# Altium schematic sheet uz_frontpanel_main-mini.SchDoc
size A4; SheetNumber: 1; SheetTotal: 3; Website: www.ultrazohm.com
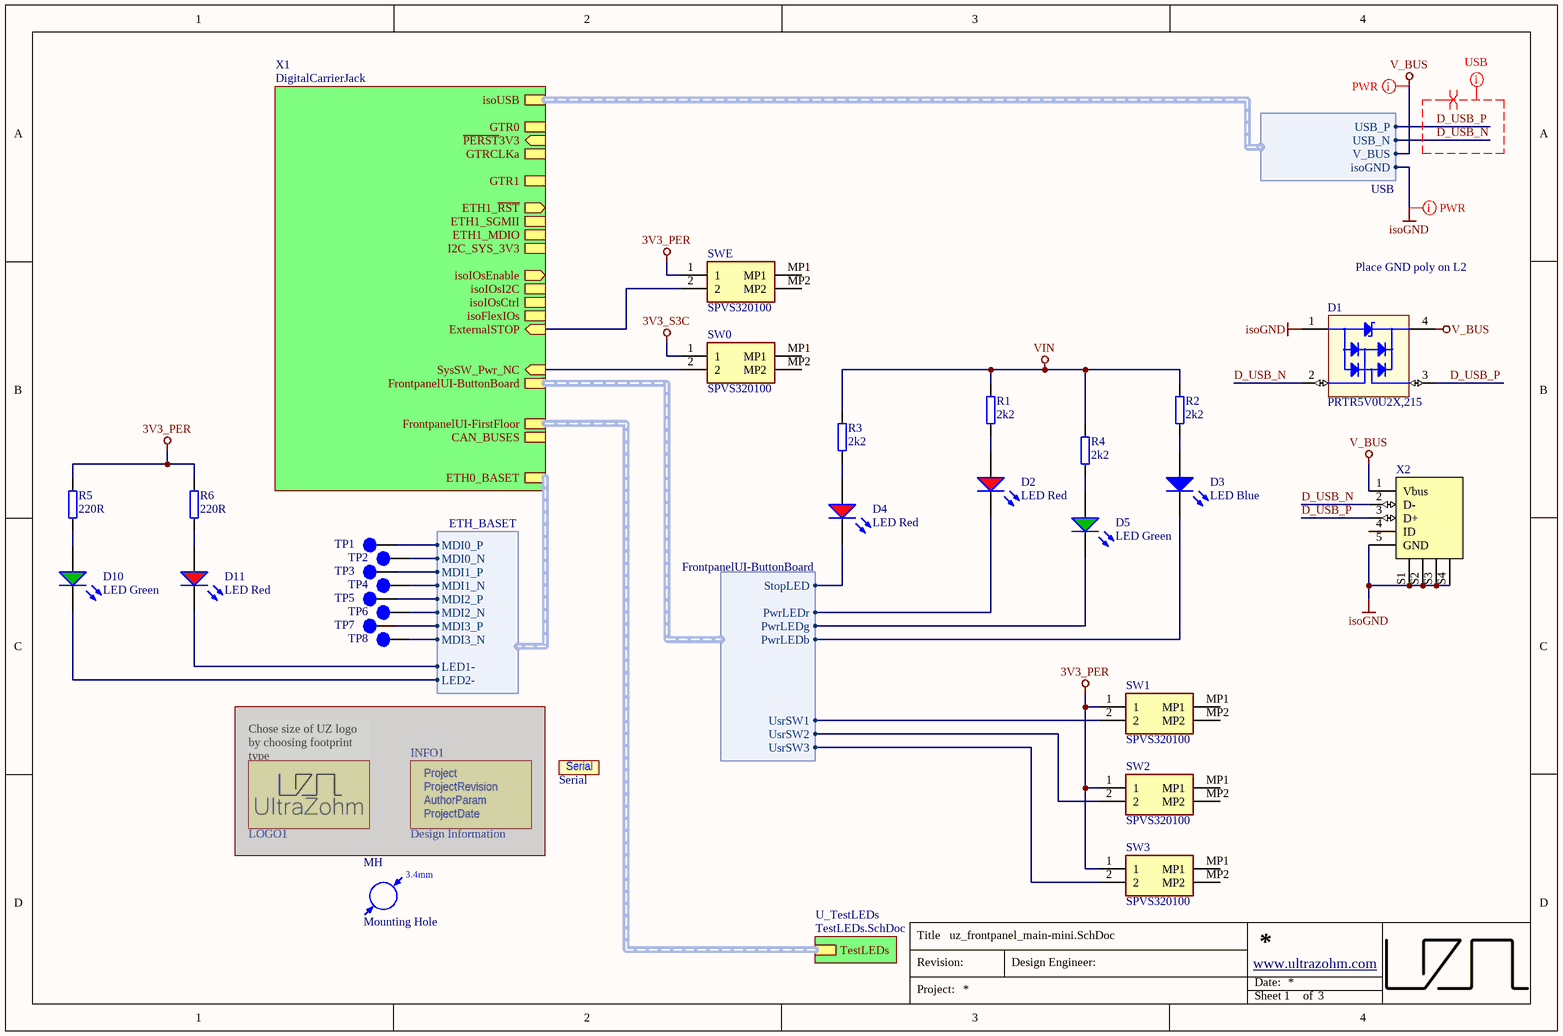
[diagram p0: uz_frontpanel_main-mini.SchDoc]

## Parts
D1  PRTR5V0U2X,215  [SOT-143B-4]
D2  LED Red  [WL-SMCW_0603]
D3  LED Blue  [WL-SMCW_0603]
D4  LED Red  [WL-SMCW_0603]
D5  LED Green  [WL-SMCW_0603]
D10  LED Green  [WL-SMCW_0603]
D11  LED Red  [WL-SMCW_0603]
INFO1  Design Information  [Design_info]  (no BOM)  (masked out: inside a compile mask, not in the netlist)
LOGO1  UZ Logo  [UZ_Logo_tiny]  (value not drawn)  (no BOM)  (masked out: inside a compile mask, not in the netlist)
MH  Mounting Hole  [MH_3.4]  (no BOM)
R1  2k2  [R_1206_TE]
R2  2k2  [R_1206_TE]
R3  2k2  [R_1206_TE]
R4  2k2  [R_1206_TE]
R5  220R  [R_0603_TE]
R6  220R  [R_0603_TE]
Serial  Serial #  [SERIAL]  (value not drawn)  (no BOM)
SW0  SPVS320100  [SPVS320100]
SW1  SPVS320100  [SPVS320100]
SW2  SPVS320100  [SPVS320100]
SW3  SPVS320100  [SPVS320100]
SWE  SPVS320100  [SPVS320100]
TP1  Testpoint 1mm  [TP_1mm]  (value not drawn)  (no BOM)
TP2  Testpoint 1mm  [TP_1mm]  (value not drawn)  (no BOM)
TP3  Testpoint 1mm  [TP_1mm]  (value not drawn)  (no BOM)
TP4  Testpoint 1mm  [TP_1mm]  (value not drawn)  (no BOM)
TP5  Testpoint 1mm  [TP_1mm]  (value not drawn)  (no BOM)
TP6  Testpoint 1mm  [TP_1mm]  (value not drawn)  (no BOM)
TP7  Testpoint 1mm  [TP_1mm]  (value not drawn)  (no BOM)
TP8  Testpoint 1mm  [TP_1mm]  (value not drawn)  (no BOM)
X2  Mini USB  [MINI_USB_5S_B _TYPE]  (value not drawn)

## Sub-sheets
U_TestLEDs = TestLEDs.SchDoc: TestLEDs (harness FrontpanelUI-FirstFloor)
X1 = DigitalCarrierJack: isoUSB (harness USB), ETH0_BASET (harness ETH_BASET), ETH1_~{RST} (out), ETH1_SGMII (harness ETH_SGMII), ETH1_MDIO (harness ETH_MDIO), GTR0 (harness GTR), ~{PERST}3V3 (in), GTRCLKa (harness MGTCLK), GTR1 (harness GTR), isoIOsEnable (out), isoIOsI2C (harness I2C), isoIOsCtrl (harness isoIOsCtrl), isoFlexIOs (harness isoFlexIOs), ExternalSTOP (in), SysSW_Pwr_NC (in), FrontpanelUI-ButtonBoard (harness FrontpanelUI-ButtonBoard), FrontpanelUI-FirstFloor (harness FrontpanelUI-FirstFloor), CAN_BUSES (harness CAN_BUSES), I2C_SYS_3V3 (harness I2C)

## Harnesses
USB: USB_P, USB_N, V_BUS, isoGND
FrontpanelUI-ButtonBoard: UsrSW1, UsrSW2, UsrSW3, StopLED, PwrLEDb, PwrLEDr, PwrLEDg
ETH_BASET: MDI0_P, MDI0_N, MDI1_P, MDI1_N, MDI2_P, MDI2_N, MDI3_P, MDI3_N, LED1-, LED2-

## Nets
3V3_PER: R5.2 R6.2 SW1.1 SW2.1 SW3.1 SWE.1
3V3_S3C: SW0.1
isoGND: D1.1(GND) X2.5(GND) X2.S1 X2.S2 X2.S3 X2.S4 ; sheet X1/isoUSB.isoGND
V_BUS: D1.4(REF) X2.1(Vbus) ; sheet X1/isoUSB.V_BUS
VIN: R1.2 R2.2 R3.2 R4.2
D_USB_N: D1.2(I/O) X2.2(D-) ; sheet X1/isoUSB.USB_N
D_USB_P: D1.3(I/O) X2.3(D+) ; sheet X1/isoUSB.USB_P
NetD2_1: D2.1(K) ; sheet X1/FrontpanelUI-ButtonBoard.PwrLEDr
NetD2_2: D2.2(A) R1.1
NetD3_1: D3.1(K) ; sheet X1/FrontpanelUI-ButtonBoard.PwrLEDb
NetD3_2: D3.2(A) R2.1
NetD4_1: D4.1(K) ; sheet X1/FrontpanelUI-ButtonBoard.StopLED
NetD4_2: D4.2(A) R3.1
NetD5_1: D5.1(K) ; sheet X1/FrontpanelUI-ButtonBoard.PwrLEDg
NetD5_2: D5.2(A) R4.1
NetD10_1: D10.1(K) ; sheet X1/ETH0_BASET.LED2-
NetD10_2: D10.2(A) R5.1
NetD11_1: D11.1(K) ; sheet X1/ETH0_BASET.LED1-
NetD11_2: D11.2(A) R6.1
NetSW0_2: SW0.2 ; sheet X1/SysSW_Pwr_NC
NetSW1_2: SW1.2 ; sheet X1/FrontpanelUI-ButtonBoard.UsrSW1
NetSW2_2: SW2.2 ; sheet X1/FrontpanelUI-ButtonBoard.UsrSW2
NetSW3_2: SW3.2 ; sheet X1/FrontpanelUI-ButtonBoard.UsrSW3
NetSWE_2: SWE.2 ; sheet X1/ExternalSTOP
NetTP1_1: TP1.1 ; sheet X1/ETH0_BASET.MDI0_P
NetTP2_1: TP2.1 ; sheet X1/ETH0_BASET.MDI0_N
NetTP3_1: TP3.1 ; sheet X1/ETH0_BASET.MDI1_P
NetTP4_1: TP4.1 ; sheet X1/ETH0_BASET.MDI1_N
NetTP5_1: TP5.1 ; sheet X1/ETH0_BASET.MDI2_P
NetTP6_1: TP6.1 ; sheet X1/ETH0_BASET.MDI2_N
NetTP7_1: TP7.1 ; sheet X1/ETH0_BASET.MDI3_P
NetTP8_1: TP8.1 ; sheet X1/ETH0_BASET.MDI3_N

Not connected (* = marked no-connect by the designer): SW0 MP1 MP2; SW1 MP1 MP2; SW2 MP1 MP2; SW3 MP1 MP2; SWE MP1 MP2; X2 4(ID)

## Buses and harness runs
harness sheet U_TestLEDs/TestLEDs = sheet X1/FrontpanelUI-FirstFloor

## Layout directives
differential pair: D_USB_N, D_USB_P
net class USB: D_USB_N, D_USB_P
net class PWR: isoGND, V_BUS

## Notes on the sheet
- Place GND poly on L2
- (near LOGO1) Chose size of UZ logo by choosing footprint type
- Title
- Revision:
- Design Engineer:
- Date:
- Project:
- Sheet
- of
- (in symbol Design Information) Project; ProjectRevision; AuthorParam; ProjectDate
- (in symbol Mounting Hole) 3.4mm

## Library data of the parts
D1 = PRTR5V0U2X,215: ESD Suppressors / TVS Diodes PRTR5V0U2X/SOT143/SOT4; Manufacturer: Nexperia; Type: TVS-Diode; Created from: AGeiger; Manufacturer Part Number: PRTR5V0U2X,215; PartID: 10; Created On: 26.11.2023 17:14:11; ComponentLink1Description: Datasheet; ComponentLink1URL: https://www.mouser.de/datasheet/2/916/PRTR5V0U2X-2938759.pdf; Component Type: TVS Diode, ESD; Device Package: SOT-143B-4; Last Updated: 26.11.2023 17:16:37; Mounting Type: SMD; Operating Temperature: -40 to 85 °C; Supplier 1: Mouser; Supplier Part Number 1: 771-PRTR5V0U2X-T/R; Supplier 2: LCSC; Supplier Part Number 2: C12333; Value: PRTR5V0U2X,215; Live Cycle Status: 1; LCSC Part Number: C12333
D2 D4 D11 = UZgen_LED_0603_Red: Standard LEDs - SMD 0603 red; Manufacturer: UZgen; Created from: UZgenTool; Manufacturer Part Number: UZgen_LED_0603_Red; PartID: 22; Created On: 09/09/2024 10:45:01; ComponentLink1Description: N/A; ComponentLink1URL: N/A; Component Type: LED Diode; Device Package: 0603; Last Updated: 09/09/2024 10:45:01; Mounting Type: SMD; Supplier 1: LCSC; Supplier Part Number 1: =LCSC Part Number; Type: Standard; Value: LED Red; Live Cycle Status: 1; Stock number: not stored; Color: red
D3 = UZgen_LED_0603_Blue: Standard LEDs - SMD 0603 blue; Manufacturer: UZgen; Created from: UZgenTool; Manufacturer Part Number: UZgen_LED_0603_Blue; PartID: 20; Created On: 09/09/2024 10:45:01; ComponentLink1Description: N/A; ComponentLink1URL: N/A; Component Type: LED Diode; Device Package: 0603; Last Updated: 09/09/2024 10:45:01; Mounting Type: SMD; Supplier 1: LCSC; Supplier Part Number 1: =LCSC Part Number; Type: Standard; Value: LED Blue; Live Cycle Status: 1; Stock number: not stored; Color: blue
D5 D10 = UZgen_LED_0603_Green: Standard LEDs - SMD 0603 green; Manufacturer: UZgen; Created from: UZgenTool; Manufacturer Part Number: UZgen_LED_0603_Green; PartID: 21; Created On: 09/09/2024 10:45:01; ComponentLink1Description: N/A; ComponentLink1URL: N/A; Component Type: LED Diode; Device Package: 0603; Last Updated: 09/09/2024 10:45:01; Mounting Type: SMD; Supplier 1: LCSC; Supplier Part Number 1: =LCSC Part Number; Type: Standard; Value: LED Green; Live Cycle Status: 1; Stock number: not stored; Color: green
INFO1 = Design Information: Manufacturer: UltraZohm; Created from: MGremer; Manufacturer Part Number: Design Information; PartID: 12; Created On: 03.11.2021 09:04:23; ComponentLink1Description: https://docs.ultrazohm.com/; ComponentLink1URL: homepage; Component Type: Design Information; Last Updated: 03.11.2021 09:28:34; Supplier 1: -; Supplier Part Number 1: -; Type: Design Information; Value: Design Information; Live Cycle Status: 1
LOGO1 = 1: Official Project Logo of the UltraZohm; Manufacturer: PCB Manufacturer; Manufacturer Part Number: UltraZohm Logo; Created from: T. Wendt; PartID: 1; Created On: 19.02.2021 16:55:56; ComponentLink1Description: Homepage; ComponentLink1URL: https://ultrazohm.com; Component Type: Logo; Last Updated: 02.03.2021 14:31:24; Type: Standard (No BOM); Live Cycle Status: 1
MH = Mounting Hole: Created from: MHlatky; Manufacturer Part Number: Mounting Hole; PartID: 16; Created On: 26/01/2021 09:19:51; ComponentLink1Description: Datasheet; Component Type: Mounting Hole; Device Package: -; Last Updated: 21/03/2022 23:05:12; Manufacturer: Mounting Hole; Supplier 1: Mounting Hole; Supplier Part Number 1: Mounting Hole; Type: Mounting Hole; Value: Mounting Hole; Live Cycle Status: 1; Stock number: not stored
R1-R4 = UZgen_R_1206_2k2: Generic resistor; Manufacturer: UZgen; Tolerance: 1 %; Created from: UZgenTool; Manufacturer Part Number: UZgen_R_1206_2k2; PartID: 516; Created On: 02/07/2024 17:29:56; Value: 2k2; Device Package: 1206; Mounting Type: SMD; Last Updated: 02/07/2024 17:29:56
R5 R6 = UZgen_R_0603_220R: Generic resistor; Manufacturer: UZgen; Tolerance: 1 %; Created from: UZgenTool; Manufacturer Part Number: UZgen_R_0603_220R; PartID: 205; Created On: 02/07/2024 17:29:49; Value: 220R; Device Package: 0603; Mounting Type: SMD; Last Updated: 02/07/2024 17:29:49
Serial = 6: Field to put in a serial number; Manufacturer: PCB Manufacturer; Created from: T. Wendt; PartID: 6; Created On: 02/03/2021 14:31:24; Component Type: Serial Number; Last Updated: 02/03/2021 14:31:24; Manufacturer Part Number: Serial Number; Type: Standard (No BOM); Live Cycle Status: 1
SW0-SW3 SWE = SPVS320100: Detector Switches 1 mAmp at 5 Volts 0.35 N; Manufacturer: Alps Alpine; Created from: FRosner; Manufacturer Part Number: SPVS320100; PartID: 45; Created On: 19/09/2024 10:04:55; ComponentLink1Description: Datasheet; ComponentLink1URL: https://www.mouser.de/datasheet/2/15/SPVS-1370820.pdf; Component Type: Detector Switches; Device Package: THT; Last Updated: 19/09/2024 10:04:55; Mounting Type: SMD; Supplier 1: Mouser; Supplier Part Number 1: 688-SPVS320100; Supplier 2: LCSC; Supplier Part Number 2: C160855; Type: Detector Switch; Value: SPVS320100; Live Cycle Status: 1; LCSC Part Number: C160855; Stock number: not stored
TP1-TP8 = NULL: Manufacturer Part Number: NULL; Created from: AGeiger; Created: 2018_06_25_AGeiger; Value: Testpoint 1mm; PartID: 9; Created On: 20/09/2022 13:14:57; Component Type: Testpoint; Last Updated: 20/09/2022 13:15:39; Manufacturer: NULL; Supplier 1: NULL; Supplier Part Number 1: NULL; Type: Testpoint; Live Cycle Status: 1
X2 = MINI 5PTP: 1A 1 Surface Mount 5P Female -30℃~+80℃ SMD USB Connectors ROHS; Manufacturer: SHOU HAN; Created from: AGeiger; Manufacturer Part Number: MINI 5PTP; PartID: 24; Created On: 26/11/2023 17:41:34; ComponentLink1Description: Datasheet; ComponentLink1URL: https://datasheet.lcsc.com/lcsc/2101221940_SHOU-HAN-MINI-5PTP_C2681563.pdf; Last Updated: 26/11/2023 17:41:34; Mounting Type: SMD; Operating Temperature: -30 °C to +80 °C; Series: Mini USB; Supplier 1: LCSC; Supplier Part Number 1: C2681563; Value: Mini USB; LCSC Part Number: C2681563